# EAGLE design pcb (EAGLE 8.6.1)
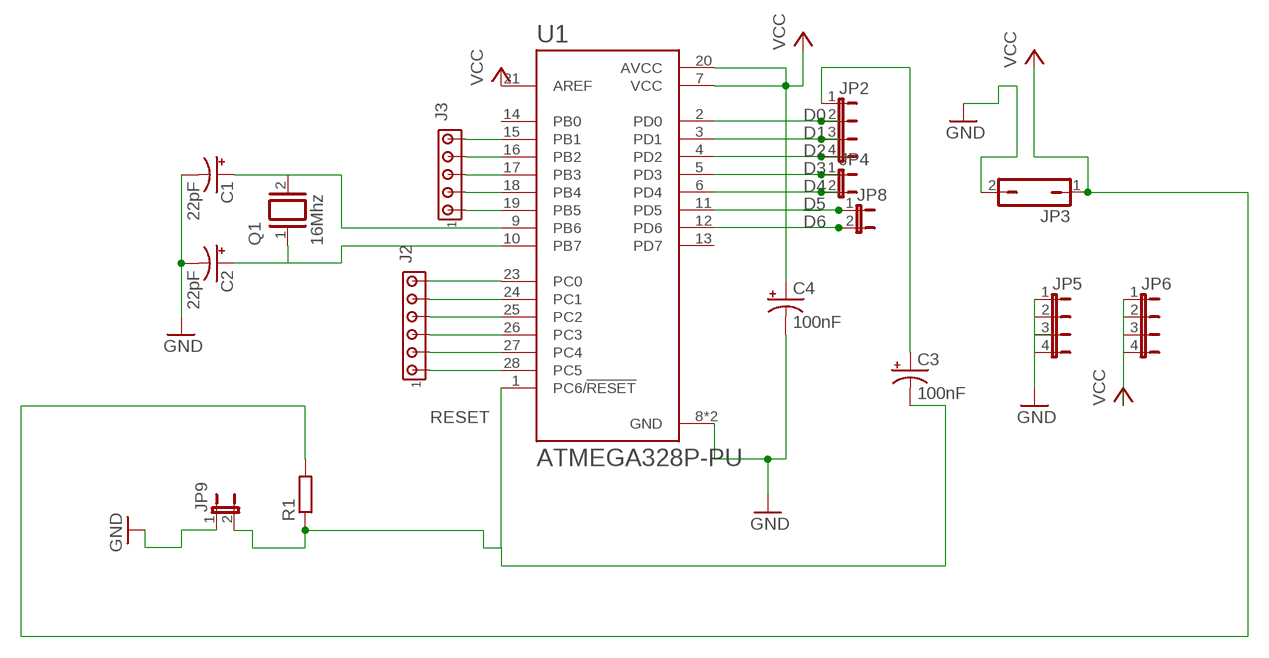
[diagram p0: schematic, sheet 1]

## Parts
C1  22pF  CPOL-USE2.5-5  [E2,5-5]
C2  22pF  CPOL-USE2.5-5  [E2,5-5]
C3  100nF  CPOL-USE2.5-5  [E2,5-5]
C4  100nF  CPOL-USE2.5-5  [E2,5-5]
J2  MTA06-100  [10X06MTA]
J3  MTA05-100  [10X05MTA]
JP2  JP4E  [JP4]
JP3  JP1Q  [JP1]
JP4  JP1E  [JP1]
JP5  JP4E  [JP4]
JP6  JP4E  [JP4]
JP8  JP1E  [JP1]
JP9  JP1E  [JP1]
Q1  16Mhz  XTAL/S  [QS]
R1  R-EU_0204/5  [0204/5]
U1  ATMEGA328P-PU  [DIP794W46P254L2967H457Q28B]

## Nets
D0: JP2.2 U1.2(PD0)
D1: JP2.3 U1.3(PD1)
D2: JP2.4 U1.4(PD2)
D3: JP4.1 U1.5(PD3)
D4: JP4.2 U1.6(PD4)
D5: JP8.1 U1.11(PD5)
D6: JP8.2 U1.12(PD6)
GND: C1.- C2.- C4.- JP3.2 JP5.1 JP5.2 JP5.3 JP5.4 JP9.1 U1.8(GND) U1.22(GND)
N$1: J2.6 U1.23(PC0)
N$2: C3.+ JP2.1
N$3: J2.5 U1.24(PC1)
N$4: J2.4 U1.25(PC2)
N$5: J2.3 U1.26(PC3)
N$6: J2.2 U1.27(PC4)
N$7: J2.1 U1.28(PC5)
N$8: J3.5 U1.15(PB1)
N$9: J3.4 U1.16(PB2)
N$10: J3.3 U1.17(PB3)
N$11: J3.2 U1.18(PB4)
N$12: J3.1 U1.19(PB5)
N$21: C1.+ Q1.2 U1.9(PB6)
N$22: C2.+ Q1.1 U1.10(PB7)
RESET: C3.- JP9.2 R1.1 U1.1(PC6/!RESET)
VCC: C4.+ JP3.1 JP6.1 JP6.2 JP6.3 JP6.4 R1.2 U1.7(VCC) U1.20(AVCC) U1.21(AREF)
Unconnected: U1.13(PD7) U1.14(PB0)

## Library data of the parts
C1-C4 = adafruit:CPOL-US: POLARIZED CAPACITOR, American symbol
J2 = con-amp:MTA06-100: AMP connector Connection corrected 2014-09-19
J3 = con-amp:MTA05-100: AMP connector
JP2 JP5 JP6 = jumper:JP4E: JUMPER
JP3 = jumper:JP1Q: JUMPER
JP4 JP8 JP9 = jumper:JP1E: JUMPER
Q1 = special:XTAL/S: CRYSTAL
R1 = resistor:R-EU_: RESISTOR, European symbol
U1 = ATMEGA328P-PU:ATMEGA328P-PU: ATmega Series 20 MHz 32 KB Flash 2 KB SRAM 8-Bit Microcontroller - DIP-28; AVAILABILITY: Good; DESCRIPTION: IC MCU 8BIT 32KB FLASH 28DIP; MF: Microchip; MP: ATMEGA328P-PU; PACKAGE: PDIP-28 Microchip; PRICE: 2.25 USD

## Board
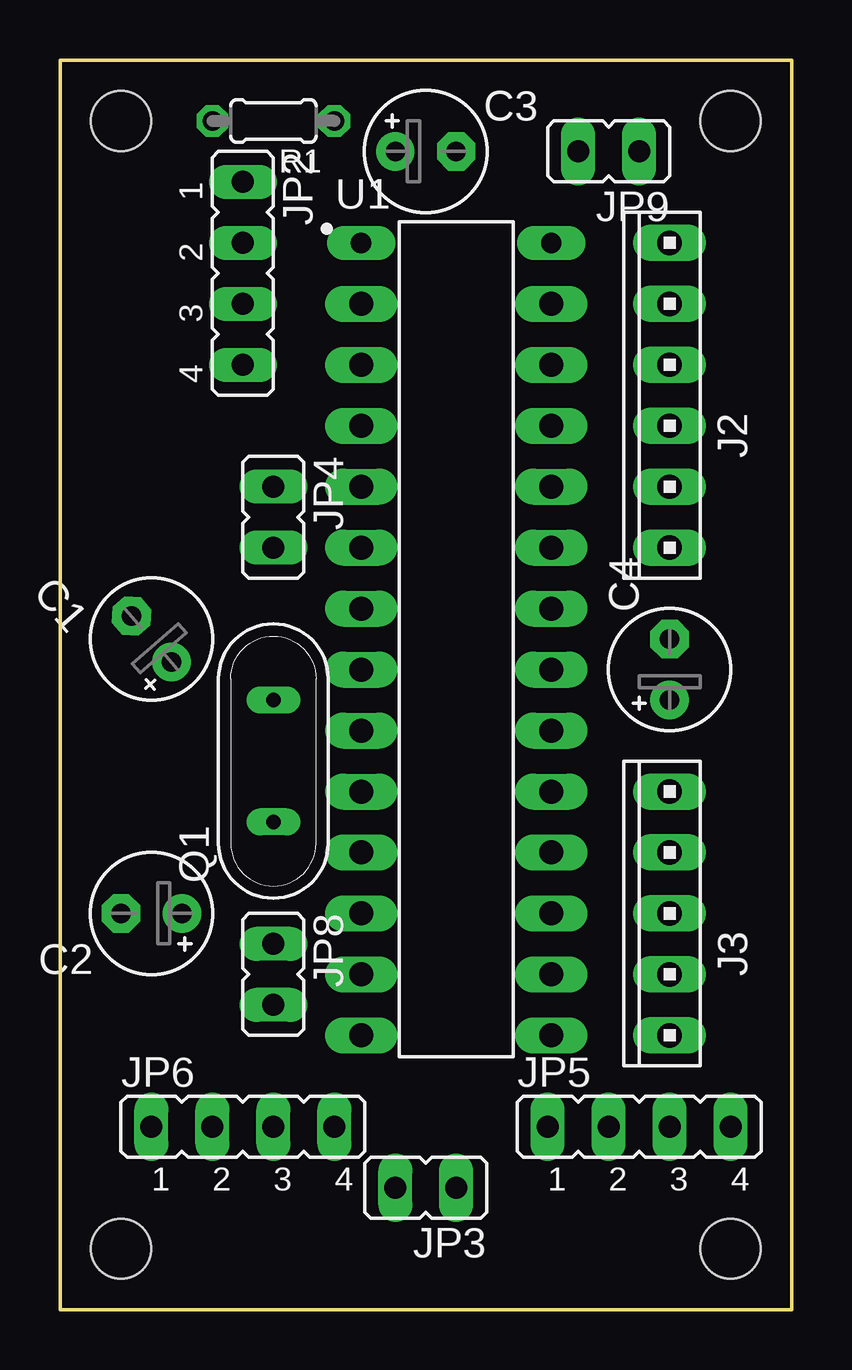
[diagram p1: board, top side]
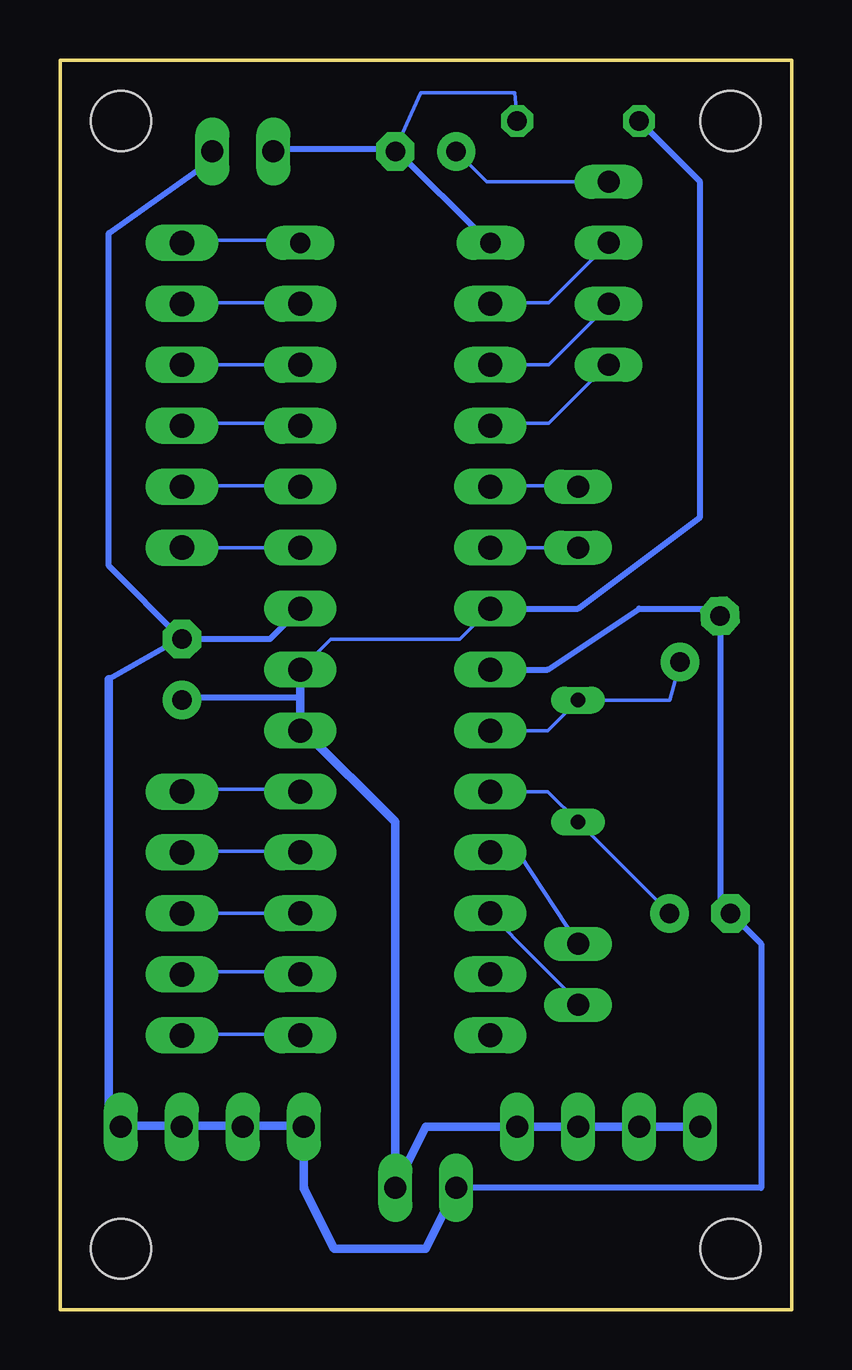
[diagram p2: board, bottom side, seen from below]

Size 30.48 x 52.07 mm. Coordinates in mm from the lower left corner, seen from the top.
Outline: 0,52.07 0,0 30.48,0 30.48,52.07 0,52.07
Copper layers (1*16): Top 0.035mm / dielectric 1.5mm / Bottom 0.035mm
Design rules "default": minimum track width 6mil, minimum drill 0.35mm, track to track 6mil, track to pad 6mil, pad to pad 6mil, via to via 6mil, smd to smd 6mil, copper to edge 40mil, drill to drill 6mil, minimum pad ring 10mil, minimum via ring 8mil, stop-mask expansion 4mil, vias tented up to drill 0mil, thermal gap 10mil
Holes 2.5 mm at 2.54,49.53 27.94,49.53 27.94,2.54 2.54,2.54

### Footprints (pad centres in the part's own frame; a part is rotated, then mirrored left to right if it is on the bottom)
E2,5-5 = drill 0.813 pad 1.6: + -1.27,0 | drill 0.813 pad 1.6 octagon: - 1.27,0
10X06MTA = drill 1.016 long: 1 6.35,0; 2 3.81,0; 3 1.27,0; 4 -1.27,0; 5 -3.81,0; 6 -6.35,0
10X05MTA = drill 1.016 long: 1 5.08,0; 2 2.54,0; 3 0,0; 4 -2.54,0; 5 -5.08,0
JP4 = drill 0.914 long: 1 -3.81,0; 2 -1.27,0; 3 1.27,0; 4 3.81,0
JP1 = drill 0.914 long: 1 0,-1.27; 2 0,1.27
QS = drill 0.61 long: 1 -2.54,0; 2 2.54,0
0204/5 = drill 0.813 octagon: 1 -2.54,0; 2 2.54,0
DIP794W46P254L2967H457Q28B = drill 0.85 pad 1.422 long: 1 -3.96,16.51; 28 3.96,16.51 | drill 1 pad 1.422 long: 2 -3.96,13.97; 3 -3.96,11.43; 4 -3.96,8.89; 5 -3.96,6.35; 6 -3.96,3.81; 7 -3.96,1.27; 8 -3.96,-1.27; 9 -3.96,-3.81; 10 -3.96,-6.35; 11 -3.96,-8.89; 12 -3.96,-11.43; 13 -3.96,-13.97; 14 -3.96,-16.51; 15 3.96,-16.51; 16 3.96,-13.97; 17 3.96,-11.43; 18 3.96,-8.89; 19 3.96,-6.35; 20 3.96,-3.81; 21 3.96,-1.27; 22 3.96,1.27; 23 3.96,3.81; 24 3.96,6.35; 25 3.96,8.89; 26 3.96,11.43; 27 3.96,13.97

### Placement (x,y rotation side)
C1  3.81,27.94 130.9 top
C2  3.81,16.51 180 top
C3  15.24,48.26 0 top
C4  25.4,26.67 90 top
J2  25.4,38.1 90 top
J3  25.4,16.51 90 top
JP2  7.62,43.18 270 top
JP3  15.24,5.08 90 top
JP4  8.89,33.02 180 top
JP5  24.13,7.62 0 top
JP6  7.62,7.62 0 top
JP8  8.89,13.97 180 top
JP9  22.86,48.26 90 top
Q1  8.89,22.86 90 top
R1  8.89,49.53 180 top
U1  16.51,27.94 0 top

### Tracks (layer width: path | path; a pad name or v marks a point on that pad's centre or on a via)
D0
  Bottom 0.152: JP2.2 10.11,41.96 12.55,41.96 U1.2
D1
  Bottom 0.152: U1.3 10.11,39.37 7.67,41.81 JP2.3
D2
  Bottom 0.152: U1.4 12.55,36.93 10.11,36.93 7.67,39.37 JP2.4
D3
  Bottom 0.152: U1.5 12.55,34.34 8.89,34.34 8.94,34.29 JP4.1
D4
  Bottom 0.152: JP4.2 U1.6
D5
  Bottom 0.152: JP8.1 11.33,18.95 12.55,18.95 U1.11
D6
  Bottom 0.152: U1.12 11.33,15.24 8.89,12.8 JP8.2
GND
  Bottom 0.152: 22.91,7.67 JP5.2 22.76,7.67 | 25.35,7.67 JP5.3 25.5,7.67 | 27.94,7.67 JP5.4 | 20.32,7.67 JP5.1 | 20.47,29.16 U1.22 | 25.35,27.94 C4.- 25.5,27.94 | 24.13,47.9 JP9.1 | U1.8 12.55,26.82 | 3.29,29.21 C1.- | 2.98,16.95 C2.-
  Bottom 0.254: 24.13,47.9 28.45,44.86 28.45,30.99 C4.- 21.74,27.94 U1.22 | 25.5,27.94 28.45,26.26 | U1.8 10.16,26.67 6.35,29.21 3.29,29.21 | C1.- 2.98,16.95 | C2.- 1.27,15.24 1.27,5.08 JP3.2
  Bottom 0.356: 25.35,7.67 22.91,7.67 | 25.5,7.67 27.94,7.67 28.45,7.67 28.45,26.26 | 20.32,7.67 22.76,7.67 | JP3.2 15.24,2.54 19.05,2.54 | 20.32,5.08 JP5.1
  Bottom 0.381: 19.05,2.54 20.32,5.08
N$1
  Bottom 0.152: J2.6 U1.23
N$2
  Bottom 0.152: JP2.1 12.7,46.99 C3.+
N$3
  Bottom 0.152: U1.24 20.47,34.34 25.35,34.34 J2.5
N$4
  Bottom 0.152: U1.25 20.47,36.93 25.35,36.93 J2.4
N$5
  Bottom 0.152: J2.3 U1.26
N$6
  Bottom 0.152: U1.27 20.47,41.96 25.35,41.96 J2.2
N$7
  Bottom 0.152: U1.28 20.47,44.55 25.35,44.55 J2.1
N$8
  Bottom 0.152: U1.15 20.47,11.48 25.35,11.48 J3.5
N$9
  Bottom 0.152: U1.16 20.47,14.07 25.35,14.07 J3.4
N$10
  Bottom 0.152: J3.3 U1.17
N$11
  Bottom 0.152: U1.18 20.47,19.1 25.35,19.1 J3.2
N$12
  Bottom 0.152: U1.19 20.47,21.69 25.35,21.69 J3.1
N$21
  Bottom 0.152: C1.+ 5.08,25.4 Q1.2 10.16,24.13 U1.9 12.7,24.13
N$22
  Bottom 0.152: 12.55,21.69 U1.10 10.16,21.59 Q1.1 C2.+ 5.18,16.51
RESET
  Bottom 0.152: R1.1 11.53,50.7 15.44,50.7 16.51,48.36 C3.- | 12.7,44.55 U1.1 | 21.54,48.36 JP9.2
  Bottom 0.254: 12.7,44.55 16.51,48.36 21.54,48.36
VCC
  Bottom 0.152: U1.20 20.32,24.13 | 20.47,26.57 U1.21 19.2,27.94 13.82,27.94 U1.7 12.55,29.31 | 25.35,25.5 C4.+
  Bottom 0.254: 20.47,25.5 25.35,25.5 | U1.7 8.89,29.21 3.81,33.02 3.81,46.99 R1.2
  Bottom 0.356: 20.47,26.57 20.47,25.5 U1.20 | 20.32,24.13 16.51,20.32 JP3.1 15.24,7.62 JP6.4 JP6.3 JP6.2 JP6.1